# EAGLE design Fader Control Attiny85 (EAGLE 9.2.2)
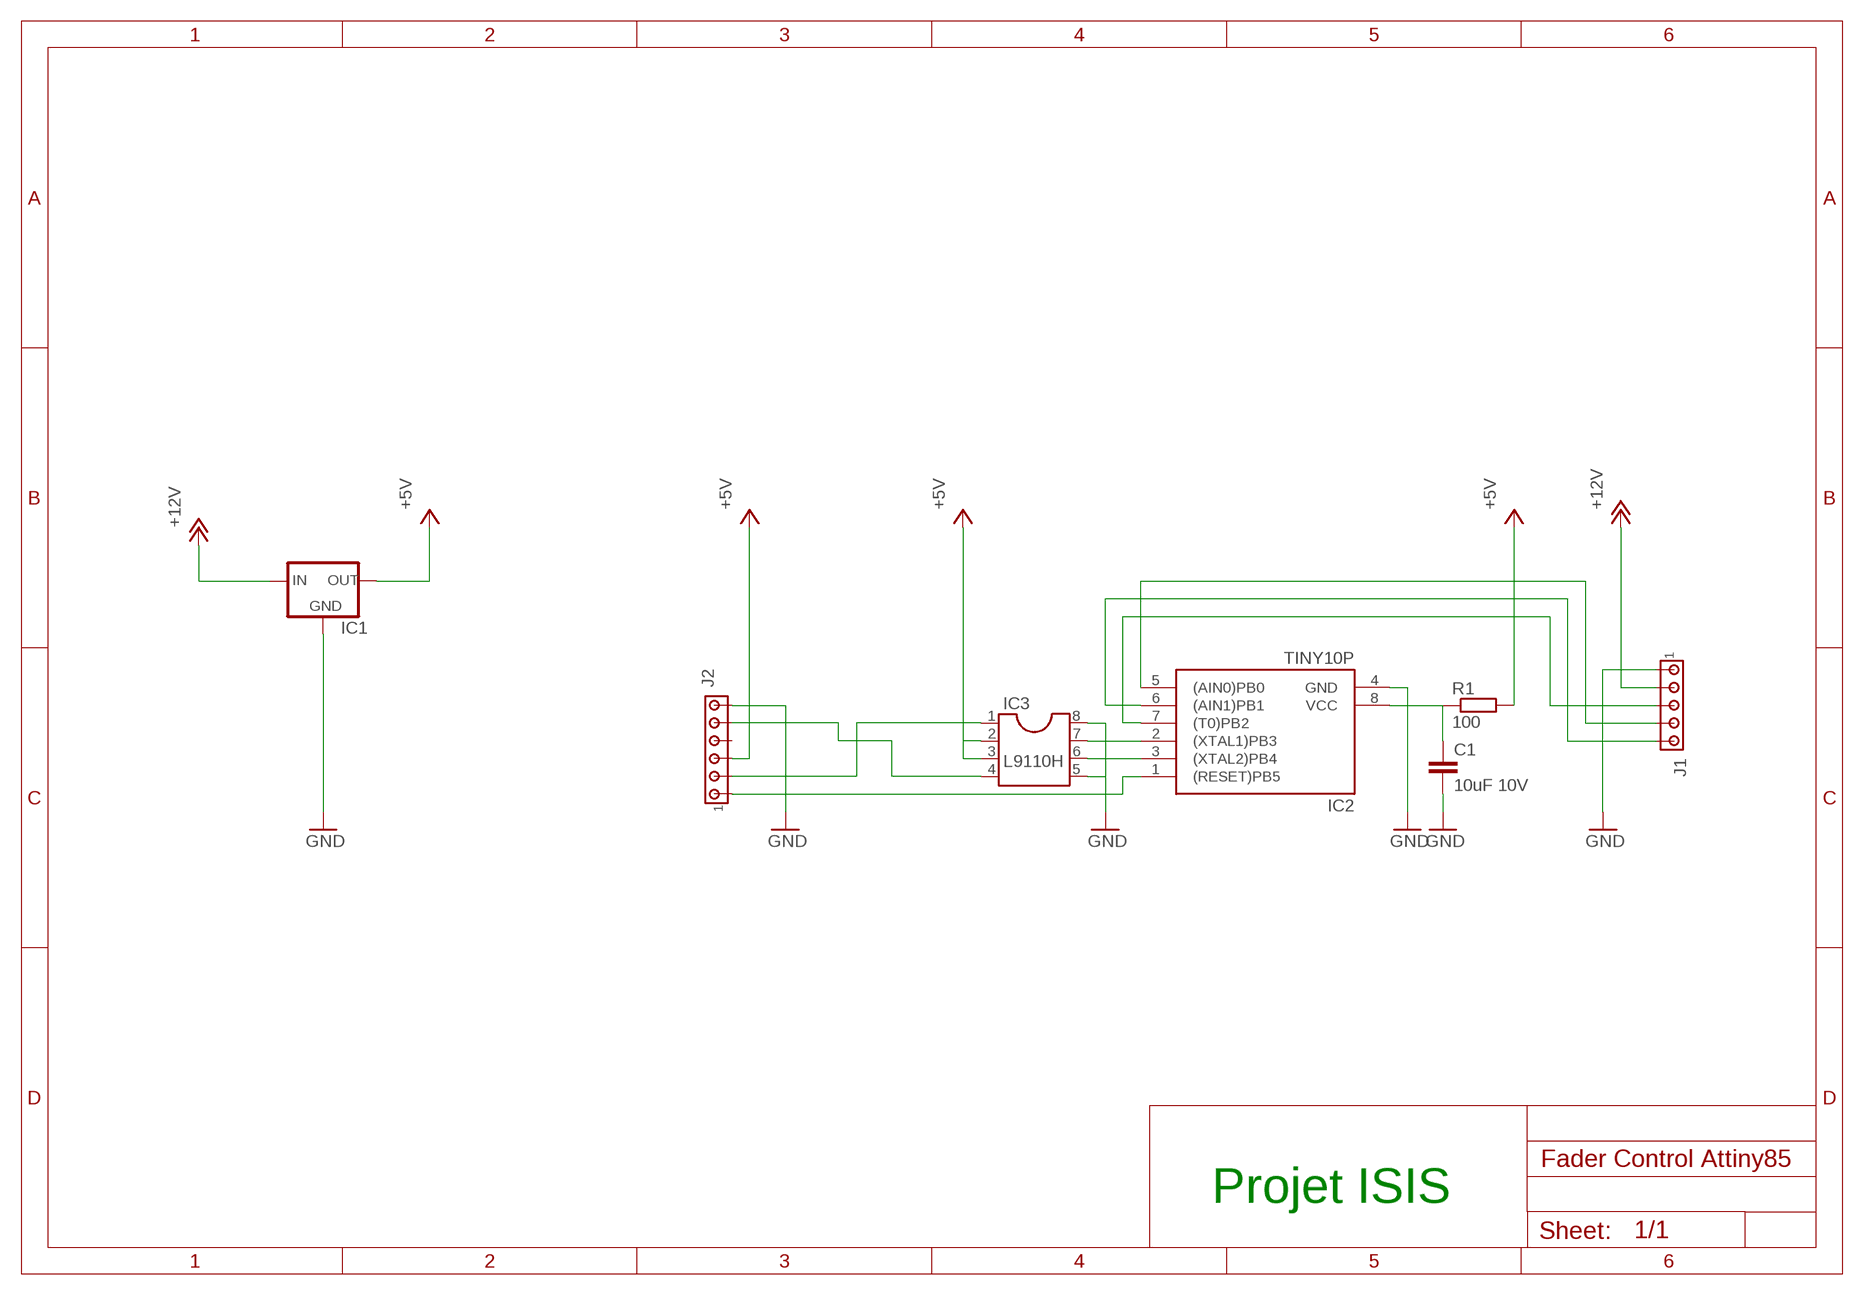
[diagram p0: schematic, sheet 1]

## Parts
C1  10uF 10V  C-EU050-024X044  [C050-024X044]
IC1  78MXXS  [78MXXS]
IC2  TINY10P  [DIL08]
IC3  L9110H  DIL8  [DIL08]
J1  MTA05-100  [10X05MTA]
J2  MTA06-100  [10X06MTA]
R1  100  R-EU_0204/7  [0204/7]

## Nets
+5V: IC1.OUT IC3.2 IC3.3 J2.3 R1.2
+12V: IC1.IN J1.2
GND: C1.2 IC1.GND IC2.4(GND) IC3.5 IC3.8 J1.1 J2.6
N$1: IC3.1 J2.2
N$2: IC3.4 J2.5
N$3: IC2.3((XTAL2)PB4) IC3.6
N$4: IC2.2((XTAL1)PB3) IC3.7
N$5: IC2.1((RESET)PB5) J2.1
N$6: C1.1 IC2.8(VCC) R1.1
N$7: IC2.7((T0)PB2) J1.3
N$8: IC2.6((AIN1)PB1) J1.5
N$9: IC2.5((AIN0)PB0) J1.4
Unconnected: J2.4

## Notes on the sheet
- Projet ISIS

## Library data of the parts
C1 = rcl:C-EU: CAPACITOR, European symbol; SPICEPREFIX: C
IC1 = v-reg:78MXXS: VOLTAGE REGULATOR
IC2 = atmel:TINY10: MICROCONTROLLER 1 Kbytes ROM; OC_FARNELL: unknown; OC_NEWARK: unknown
IC3 = ic-package:DIL8: Dual In Line / Socket
J1 = con-amp:MTA05-100: AMP connector
J2 = con-amp:MTA06-100: AMP connector Connection corrected 2014-09-19
R1 = rcl:R-EU_: RESISTOR, European symbol; SPICEPREFIX: R

## Board
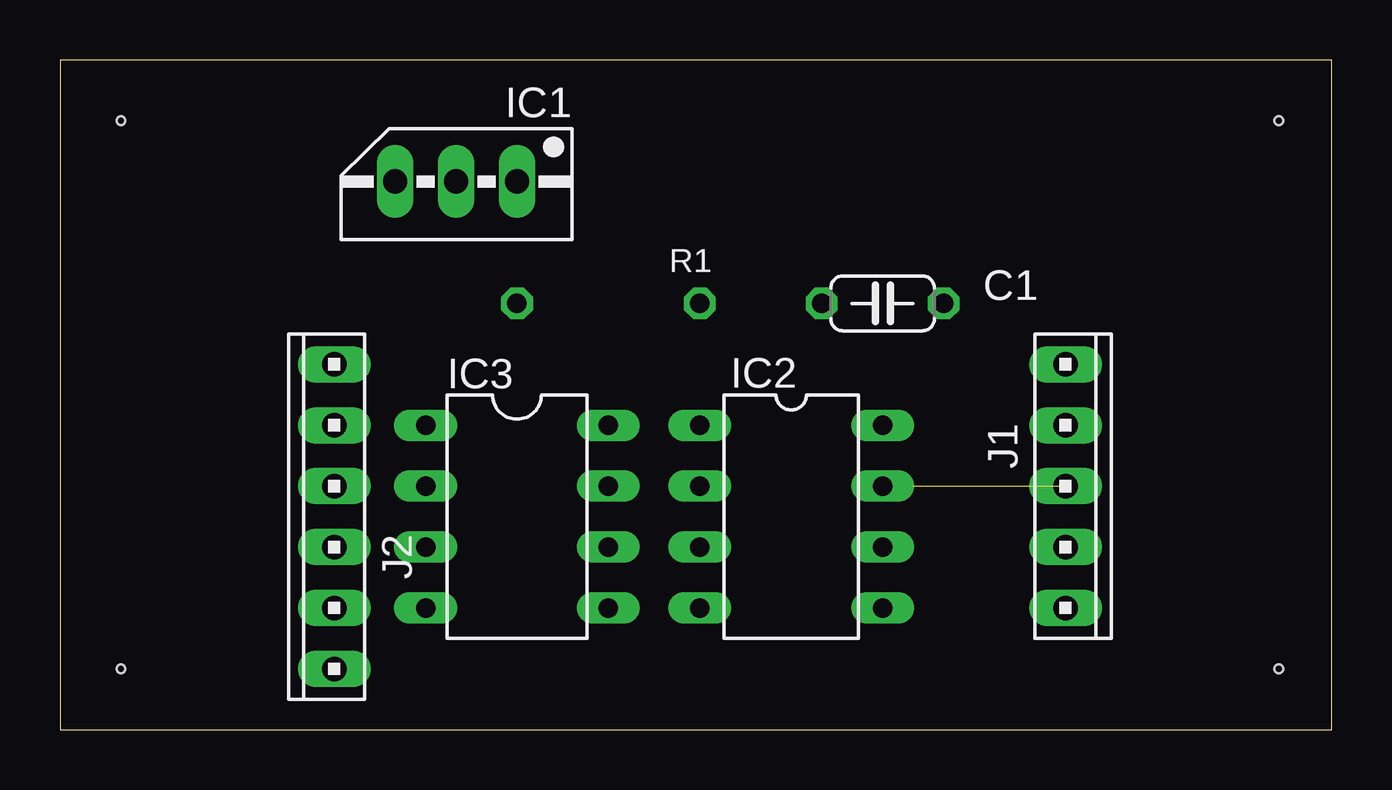
[diagram p1: board, top side]
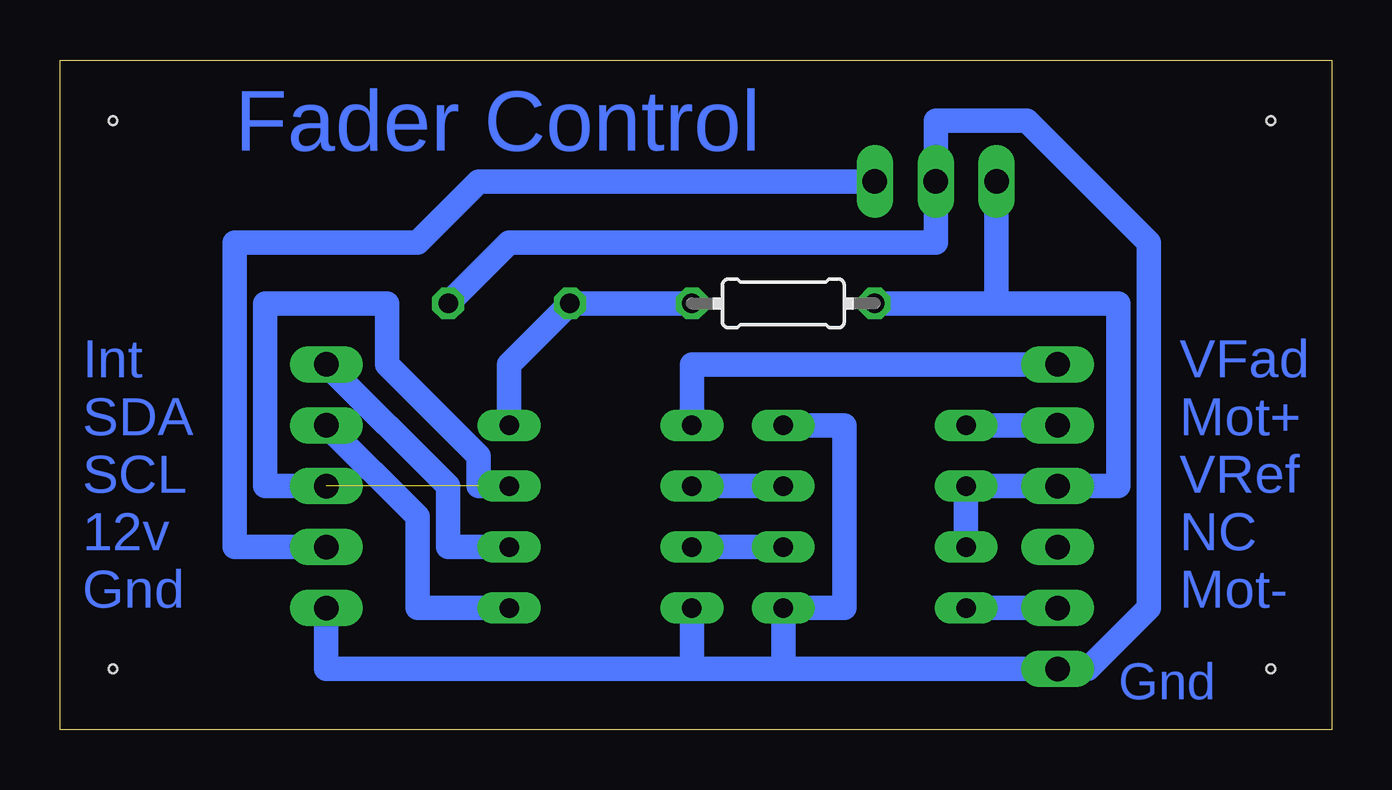
[diagram p2: board, bottom side, seen from below]

Size 53.01 x 27.93 mm. Coordinates in mm from the lower left corner, seen from the top.
Outline: 0,0 53.01,0 53.01,27.93 0,27.93 0,0
Copper layers (1*16): Top 0.035mm / dielectric 1.5mm / Bottom 0.035mm
Design rules "default": minimum track width 6mil, minimum drill 0.35mm, track to track 6mil, track to pad 6mil, pad to pad 6mil, via to via 6mil, smd to smd 6mil, copper to edge 40mil, drill to drill 6mil, minimum pad ring 10mil, minimum via ring 8mil, stop-mask expansion 4mil, vias tented up to drill 0mil, thermal gap 10mil
Holes 0.35 mm at 2.54,2.54 2.54,25.4 50.8,25.4 50.8,2.54

### Footprints (pad centres in the part's own frame; a part is rotated, then mirrored left to right if it is on the bottom)
C050-024X044 = drill 0.813 octagon: 1 -2.54,0; 2 2.54,0
78MXXS = drill 1.016 long: GND 0,-2.54; IN -2.54,-2.54; OUT 2.54,-2.54
DIL08 = drill 0.813 long: 1 -3.81,-3.81; 2 -1.27,-3.81; 3 1.27,-3.81; 4 3.81,-3.81; 5 3.81,3.81; 6 1.27,3.81; 7 -1.27,3.81; 8 -3.81,3.81
10X05MTA = drill 1.016 long: 1 5.08,0; 2 2.54,0; 3 0,0; 4 -2.54,0; 5 -5.08,0
10X06MTA = drill 1.016 long: 1 6.35,0; 2 3.81,0; 3 1.27,0; 4 -1.27,0; 5 -3.81,0; 6 -6.35,0
0204/7 = drill 0.813 octagon: 1 -3.81,0; 2 3.81,0

### Placement (x,y rotation side)
C1  34.29,17.78 0 top
IC1  16.51,20.32 180 top
IC2  30.48,8.89 270 top
IC3  19.05,8.89 270 top
J1  41.91,10.16 270 top
J2  11.43,8.89 90 top
R1  22.86,17.78 0 bottom

### Tracks (layer width: path | path; a pad name or v marks a point on that pad's centre or on a via)
+5V
  Bottom 1.016: IC3.3 IC3.2 J2.3 8.89,10.16 8.89,17.78 13.97,17.78 | IC1.OUT 13.97,17.78 | R1.2 13.97,17.78
+12V
  Bottom 1.016: J1.2 45.72,7.62 45.72,20.32 38.1,20.32 35.56,22.86 IC1.IN
GND
  Bottom 1.016: 22.86,2.54 J2.6 10.16,2.54 7.62,5.08 7.62,20.32 12.7,25.4 16.51,25.4 IC1.GND 16.51,20.32 34.29,20.32 C1.2 | 22.86,2.54 IC3.5 20.32,5.08 20.32,12.7 IC3.8 | 26.67,2.54 22.86,2.54 | IC2.4 26.67,2.54 | J1.1 41.91,2.54 26.67,2.54
N$1
  Bottom 1.016: J2.2 IC3.1
N$2
  Bottom 1.016: J2.5 IC3.4
N$3
  Bottom 1.016: IC3.6 IC2.3
N$4
  Bottom 1.016: IC3.7 IC2.2
N$5
  Bottom 1.016: J2.1 26.67,15.24 IC2.1
N$6
  Bottom 1.016: R1.1 C1.1 34.29,15.24 IC2.8
N$7  (1 unrouted)
  Bottom 1.016: IC2.7 35.56,10.16 35.56,11.43 39.37,15.24 39.37,17.78 44.45,17.78 44.45,10.16 J1.3
N$8
  Bottom 1.016: IC2.6 36.83,7.62 36.83,10.16 J1.5
N$9
  Bottom 1.016: IC2.5 38.1,5.08 38.1,8.89 J1.4

### Text on the board
Bottom: Fader Control | VFad / Mot+ / VRef / NC / Mot- | Int / SDA / SCL / 12v / Gnd | Gnd